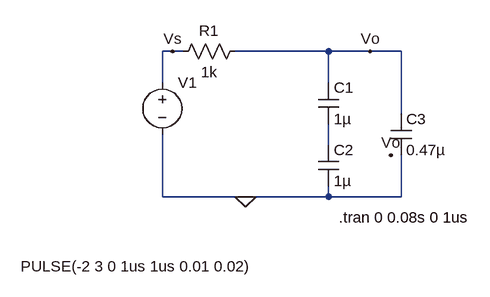
[diagram p0: schematic lab8 task01.asc]
lab8 task01.asc, the LTspice schematic file:
Version 4
SHEET 1 880 680
WIRE 96 32 80 32
WIRE 112 32 96 32
WIRE 336 32 192 32
WIRE 400 32 336 32
WIRE 448 32 400 32
WIRE 80 80 80 32
WIRE 336 80 336 32
WIRE 448 128 448 32
WIRE 336 176 336 144
WIRE 80 256 80 160
WIRE 208 256 80 256
WIRE 336 256 336 240
WIRE 336 256 208 256
WIRE 448 256 448 192
WIRE 448 256 336 256
FLAG 208 256 0
FLAG 96 32 Vs
FLAG 432 192 Vo
FLAG 400 32 Vo
SYMBOL voltage 80 64 R0
WINDOW 3 -218 299 Left 2
WINDOW 123 0 0 Left 0
SYMATTR InstName V1
SYMATTR Value PULSE(-2 3 0 1us 1us 0.01 0.02)
SYMBOL res 96 48 R270
WINDOW 0 32 56 VTop 2
WINDOW 3 0 56 VBottom 2
SYMATTR InstName R1
SYMATTR Value 1k
SYMBOL cap 320 176 R0
SYMATTR InstName C2
SYMATTR Value 1µ
SYMBOL cap 432 128 R0
SYMATTR InstName C3
SYMATTR Value 0.47µ
SYMBOL cap 320 80 R0
SYMATTR InstName C1
SYMATTR Value 1µ
TEXT 352 288 Left 2 !.tran 0 0.08s 0 1us

The netlist it stands for:
* lab8 task01.asc
V1 Vs 0 PULSE(-2 3 0 1us 1us 0.01 0.02)
R1 Vs Vo 1k
C2 N001 0 1µ
C3 Vo 0 0.47µ
C1 Vo N001 1µ
.tran 0 0.08s 0 1us
.backanno
.end